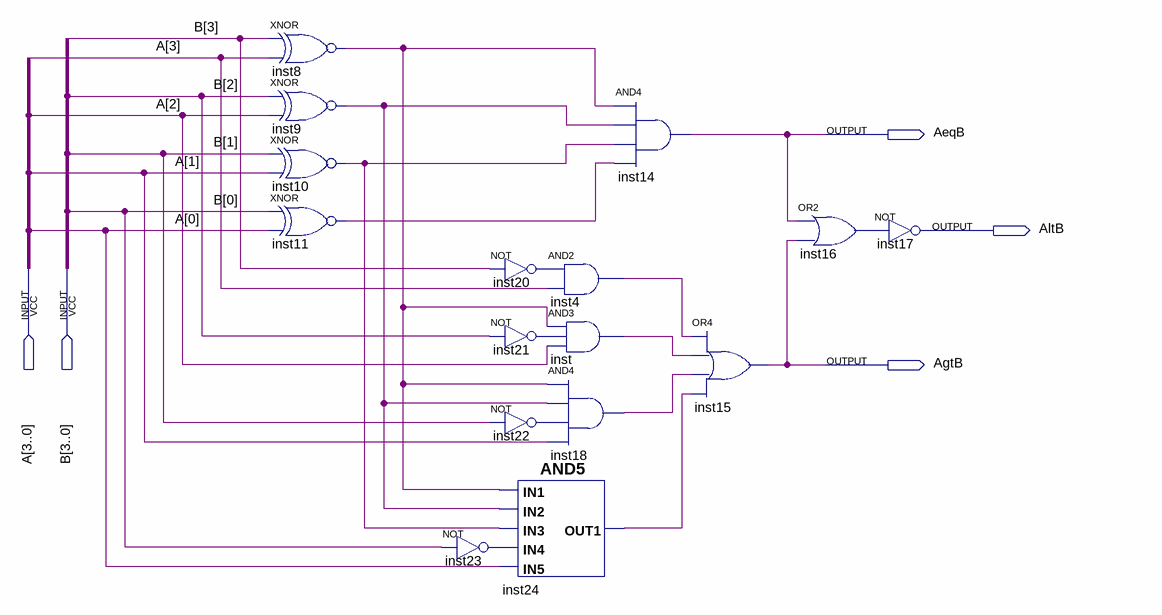
[diagram p0: schematic sheet]
// Quartus schematic Block2.bdf as structural Verilog: 16 symbols, 5 pins
module Block2 (
  input  [3:0] A,
  input  [3:0] B,
  output AeqB,
  output AltB,
  output AgtB
);

  wire inst4_out, inst8_out, inst9_out, inst10_out, inst11_out, inst16_out, inst18_out, inst20_out,
       inst21_out, inst22_out, inst23_out, inst24_out1, inst_out;

  xnor inst8 (inst8_out, B[3], A[3]);
  xnor inst9 (inst9_out, B[2], A[2]);
  xnor inst10 (inst10_out, B[1], A[1]);
  xnor inst11 (inst11_out, B[0], A[0]);
  not inst20 (inst20_out, B[3]);
  not inst21 (inst21_out, B[2]);
  not inst22 (inst22_out, B[1]);
  AND5 inst24 (.IN3(inst10_out), .IN2(inst9_out), .IN1(inst8_out), .IN5(A[0]), .IN4(inst23_out), .OUT1(inst24_out1));
  not inst23 (inst23_out, B[0]);
  and inst4 (inst4_out, inst20_out, A[3]);
  and inst (inst_out, inst8_out, inst21_out, A[2]);
  and inst18 (inst18_out, inst8_out, inst9_out, inst22_out, A[1]);
  and inst14 (AeqB, inst8_out, inst9_out, inst10_out, inst11_out);
  or inst15 (AgtB, inst4_out, inst_out, inst18_out, inst24_out1);
  or inst16 (inst16_out, AeqB, AgtB);
  not inst17 (AltB, inst16_out);
endmodule
